# EAGLE design core-debug (EAGLE 6.4)
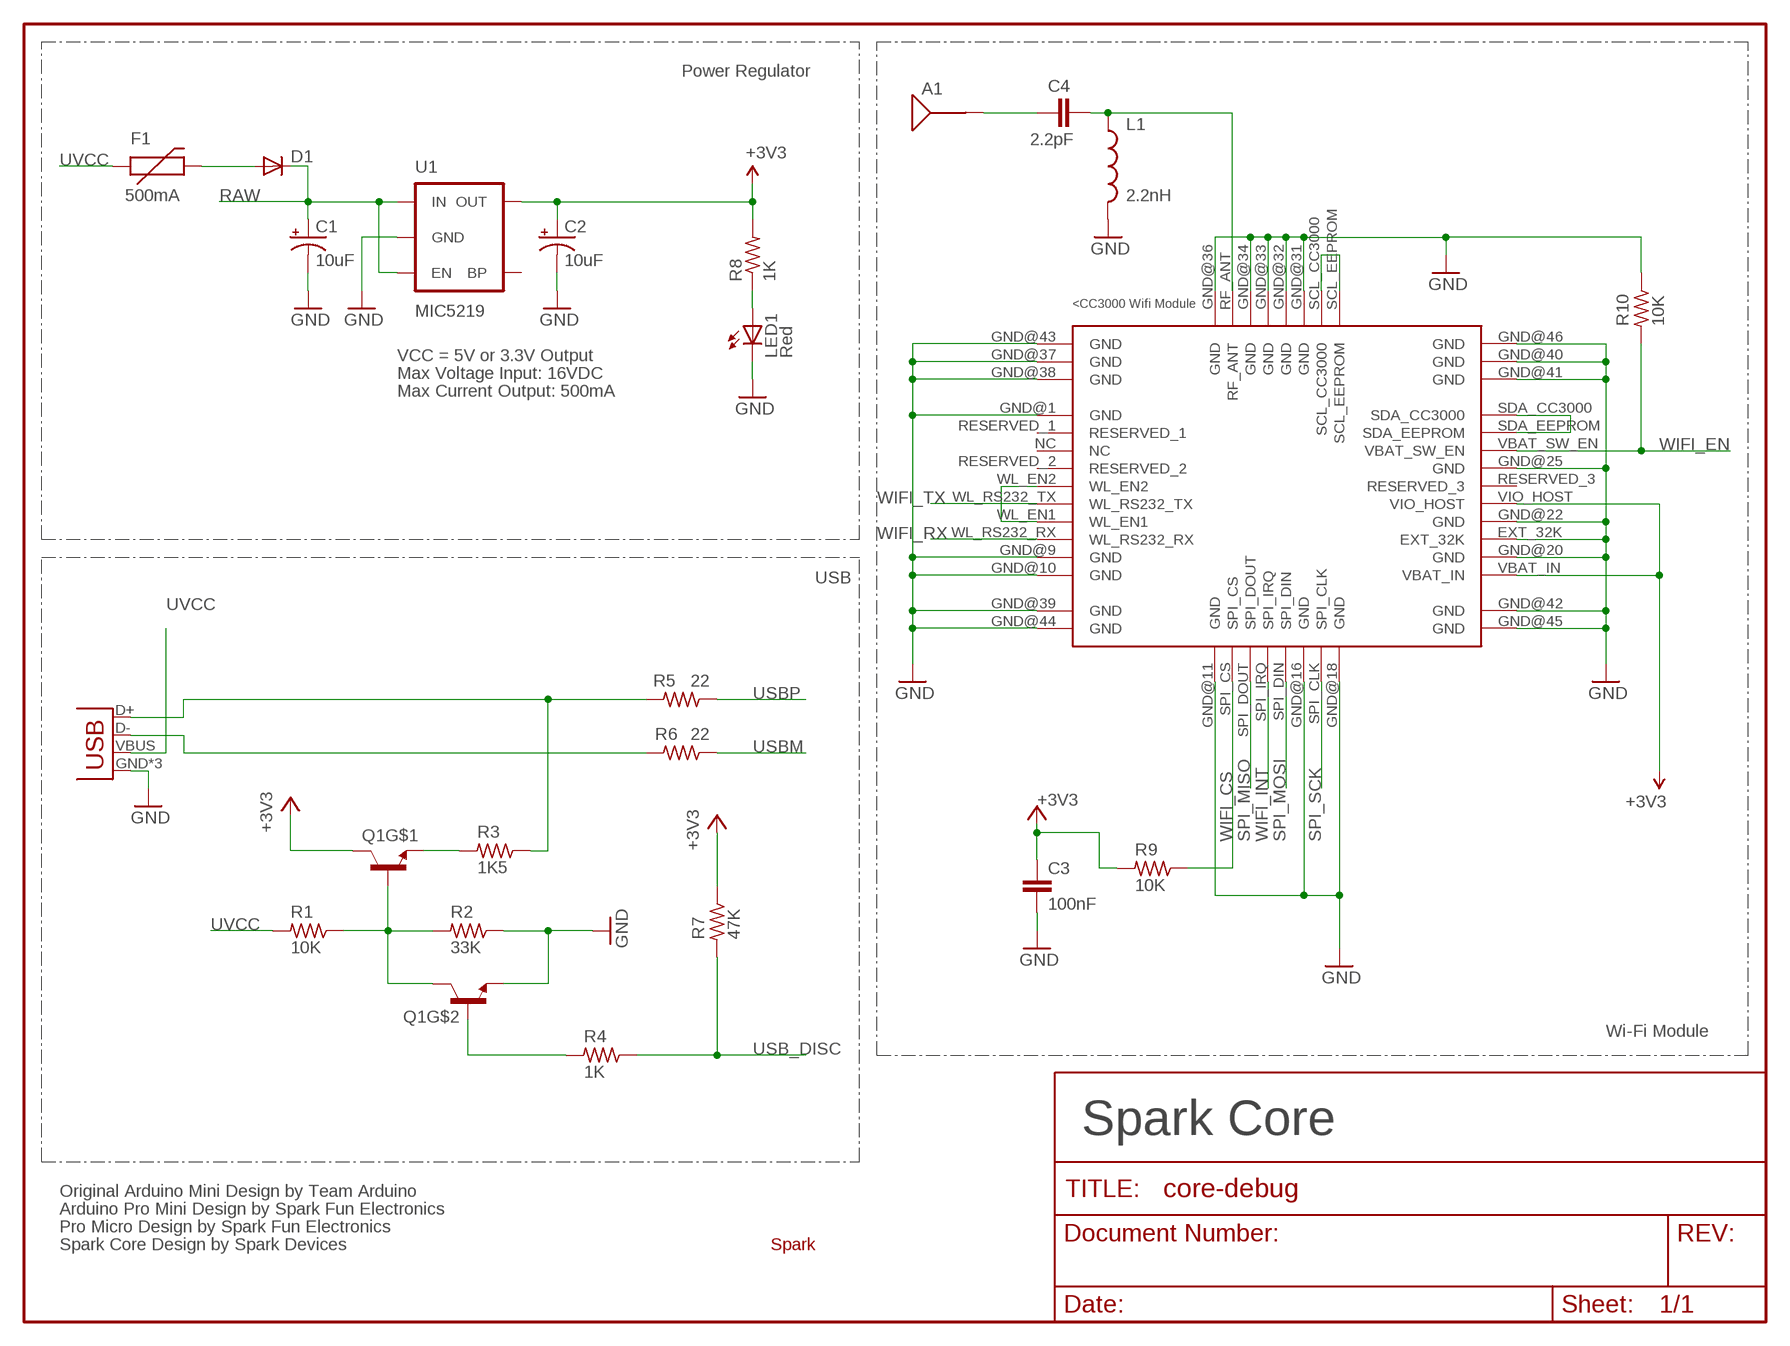
[diagram p0: schematic, sheet 1, part 1 of 2]
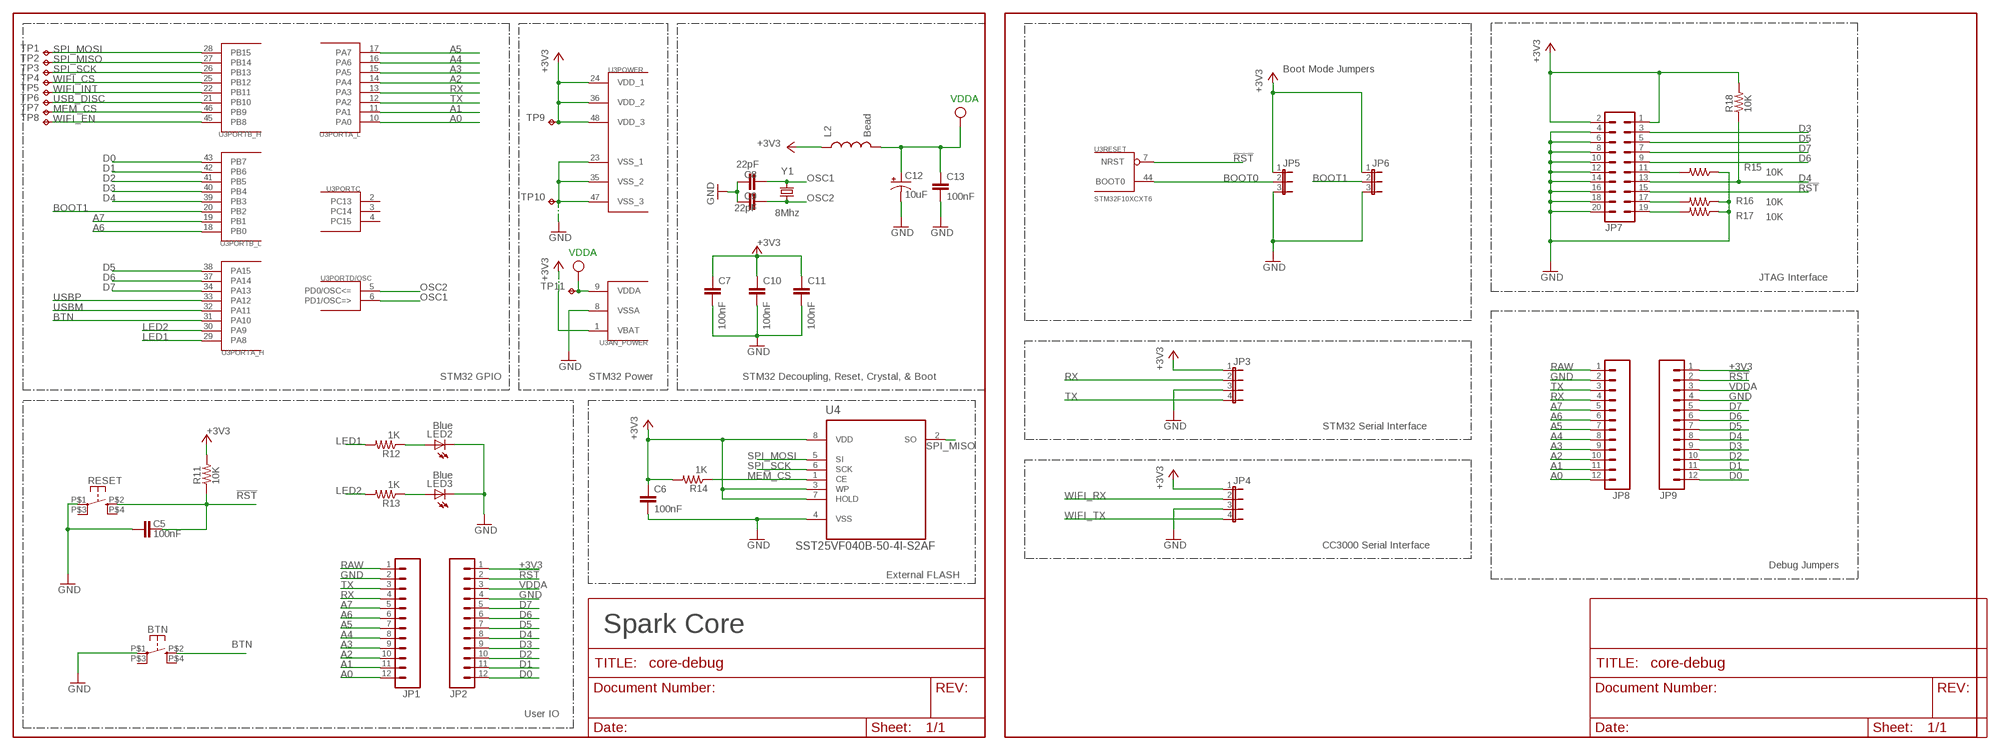
[diagram p1: schematic, sheet 1, part 2 of 2]

## Parts
A1  ANTENNA2SMD5  [ANTENNA-CHIP5]
BTN  KMR211GLFS  BUTTON-KMR241GLFS  [PUSHBUTTON-KMR241GLFS]
C1  10uF  CAP_POL1206  [EIA3216]
C2  10uF  CAP_POL1206  [EIA3216]
C3  100nF  C-EUC0603  [C0603]
C4  2.2pF  C-EUC0603  [C0603]
C5  100nF  C-EUC0603  [C0603]
C6  100nF  C-EUC0603  [C0603]
C7  100nF  C-EUC0603  [C0603]
C8  22pF  C-EUC0603  [C0603]
C9  22pF  C-EUC0603  [C0603]
C10  100nF  C-EUC0603  [C0603]
C11  100nF  C-EUC0603  [C0603]
C12  10uF  CAP_POL1206  [EIA3216]
C13  100nF  C-EUC0603  [C0603]
D1  DIODESOD  [SOD-323]
F1  500mA  PTCSMD  [PTC-1206]
JP1  M12PTH  [1X12]
JP2  M12PTH  [1X12]
JP3  JP4E  [JP4]
JP4  JP4E  [JP4]
JP5  JP2E  [JP2]
JP6  JP2E  [JP2]
JP7  ML20  [ML20]
JP8  M12PTH  [1X12]
JP9  M12PTH  [1X12]
L1  2.2nH  INDUCTOR0603  [0603]
L2  Bead  INDUCTOR0603  [0603]
LED1  Red  LED0603  [LED-0603]
LED2  Blue  LED0603  [LED-0603]
LED3  Blue  LED0603  [LED-0603]
Q1  MMDT3904  [SOT363]
R1  10K  R-US_R0603  [R0603]
R2  33K  R-US_R0603  [R0603]
R3  1K5  R-US_R0603  [R0603]
R4  1K  R-US_R0603  [R0603]
R5  22  R-US_R0603  [R0603]
R6  22  R-US_R0603  [R0603]
R7  47K  R-US_R0603  [R0603]
R8  1K  R-US_R0603  [R0603]
R9  10K  R-US_R0603  [R0603]
R10  10K  R-US_R0603  [R0603]
R11  10K  R-US_R0603  [R0603]
R12  1K  R-US_R0603  [R0603]
R13  1K  R-US_R0603  [R0603]
R14  1K  R-US_R0603  [R0603]
R15  10K  R-US_R0603  [R0603]
R16  10K  R-US_R0603  [R0603]
R17  10K  R-US_R0603  [R0603]
R18  10K  R-US_R0603  [R0603]
RESET  KMR211GLFS  BUTTON-KMR241GLFS  [PUSHBUTTON-KMR241GLFS]
TP1  TPPAD1-17  [P1-17]
TP2  TPPAD1-17  [P1-17]
TP3  TPPAD1-17  [P1-17]
TP4  TPPAD1-17  [P1-17]
TP5  TPPAD1-17  [P1-17]
TP6  TPPAD1-17  [P1-17]
TP7  TPPAD1-17  [P1-17]
TP8  TPPAD1-17  [P1-17]
TP9  TPPAD1-17  [P1-17]
TP10  TPPAD1-17  [P1-17]
TP11  TPPAD1-17  [P1-17]
U1  MIC5219  V_REG_LDOSMD  [SOT23-5]
U2  CC3000  [CC3000]
U3  STM32F10XCXT6  [TQFP48]
U4  SST25VF040B-50-4I-S2AF  [SOIC127P790X216-8N]
U$1  SPARK_LOGO2  [SPARK_LOGO2]
X1  USB-MICROB  [USB-MICROB]
Y1  8Mhz  CRYSTAL5X3  [CRYSTAL-SMD-5X3]

## Nets
!RST: C5.2 JP2.2 JP7.15 JP9.2 R11.1 RESET.P$2 U3.7(RESET:NRST)
+3V3: C2.A(+) C3.1 C6.1 C7.1 C10.1 C11.1 JP2.1 JP3.1 JP4.1 JP5.1 JP6.1 JP7.1 JP7.2 JP9.1 L2.1 Q1.3(C) R7.1 R8.2 R9.2 R11.2 R14.2 R18.2 TP9.TP U1.5(OUT) U2.VBAT_IN U2.VIO_HOST U3.1(AN_POWER:VBAT) U3.24(POWER:VDD_1) U3.36(POWER:VDD_2) U3.48(POWER:VDD_3) U4.3(WP) U4.7(HOLD) U4.8(VDD)
A0: JP1.12 JP8.12 U3.10(PORTA_L:PA0)
A1: JP1.11 JP8.11 U3.11(PORTA_L:PA1)
A2: JP1.10 JP8.10 U3.14(PORTA_L:PA4)
A3: JP1.9 JP8.9 U3.15(PORTA_L:PA5)
A4: JP1.8 JP8.8 U3.16(PORTA_L:PA6)
A5: JP1.7 JP8.7 U3.17(PORTA_L:PA7)
A6: JP1.6 JP8.6 U3.18(PORTB_L:PB0)
A7: JP1.5 JP8.5 U3.19(PORTB_L:PB1)
BOOT0: JP5.2 U3.44(RESET:BOOT0)
BOOT1: JP6.2 U3.20(PORTB_L:PB2)
BTN: BTN.P$2 U3.31(PORTA_H:PA10)
D0: JP2.12 JP9.12 U3.43(PORTB_L:PB7)
D1: JP2.11 JP9.11 U3.42(PORTB_L:PB6)
D2: JP2.10 JP9.10 U3.41(PORTB_L:PB5)
D3: JP2.9 JP7.3 JP9.9 U3.40(PORTB_L:PB4)
D4: JP2.8 JP7.13 JP9.8 R18.1 U3.39(PORTB_L:PB3)
D5: JP2.7 JP7.5 JP9.7 U3.38(PORTA_H:PA15)
D6: JP2.6 JP7.9 JP9.6 U3.37(PORTA_H:PA14)
D7: JP2.5 JP7.7 JP9.5 U3.34(PORTA_H:PA13)
GND [vcc]: BTN.P$1 C1.C(-) C2.C(-) C3.2 C5.1 C6.2 C7.2 C8.2 C9.2 C10.2 C11.2 C12.C(-) C13.2 JP1.2 JP2.4 JP3.3 JP4.3 JP5.3 JP6.3 JP7.4 JP7.6 JP7.8 JP7.10 JP7.12 JP7.14 JP7.16 JP7.18 JP7.20 JP8.2 JP9.4 L1.2 LED1.C LED2.C LED3.C Q1.1(E) R2.1 R10.1 R15.1 R16.1 R17.1 RESET.P$1 TP10.TP U1.2(GND) U2.EXT_32K U2.GND@1(GND) U2.GND@9(GND) U2.GND@10(GND) U2.GND@11(GND) U2.GND@16(GND) U2.GND@18(GND) U2.GND@20(GND) U2.GND@22(GND) U2.GND@25(GND) U2.GND@31(GND) U2.GND@32(GND) U2.GND@33(GND) U2.GND@34(GND) U2.GND@36(GND) U2.GND@37(GND) U2.GND@38(GND) U2.GND@39(GND) U2.GND@40(GND) U2.GND@41(GND) U2.GND@42(GND) U2.GND@43(GND) U2.GND@44(GND) U2.GND@45(GND) U2.GND@46(GND) U3.8(AN_POWER:VSSA) U3.23(POWER:VSS_1) U3.35(POWER:VSS_2) U3.47(POWER:VSS_3) U4.4(VSS) X1.GND X1.MT1(GND) X1.MT2(GND)
LED1: R12.2 U3.29(PORTA_H:PA8)
LED2: R13.2 U3.30(PORTA_H:PA9)
MEM_CS: R14.1 TP7.TP U3.46(PORTB_H:PB9) U4.1(CE)
N$1: R3.1 R5.2 X1.D+
N$2: LED2.A R12.1
N$3: D1.2(A) F1.2
N$4: C4.2 L1.1 U2.RF_ANT
N$5: A1.FEED(SIGNAL) C4.1
N$6: R6.2 X1.D-
N$7: U2.SCL_CC3000 U2.SCL_EEPROM
N$8: Q1.2(B) R4.2
N$9: U2.WL_EN1 U2.WL_EN2
N$10: LED3.A R13.1
N$11: JP7.19 R17.2
N$12: JP7.11 R15.2
N$13: Q1.5(B) Q1.6(C) R1.1 R2.2
N$14: JP7.17 R16.2
N$15: U2.SDA_CC3000 U2.SDA_EEPROM
N$16: Q1.4(E) R3.2
N$38: LED1.A R8.1
OSC1: C8.1 U3.6(PORTD/OSC:PD1/OSC=>) Y1.3
OSC2: C9.1 U3.5(PORTD/OSC:PD0/OSC<=) Y1.1
RAW [vcc]: C1.A(+) D1.1(C) JP1.1 JP8.1 U1.1(IN) U1.3(EN)
RX: JP1.4 JP3.2 JP8.4 U3.13(PORTA_L:PA3)
SPI_MISO: TP2.TP U2.SPI_DOUT U3.27(PORTB_H:PB14) U4.2(SO)
SPI_MOSI: TP1.TP U2.SPI_DIN U3.28(PORTB_H:PB15) U4.5(SI)
SPI_SCK: TP3.TP U2.SPI_CLK U3.26(PORTB_H:PB13) U4.6(SCK)
TX: JP1.3 JP3.4 JP8.3 U3.12(PORTA_L:PA2)
USB_DISC: R4.1 R7.2 TP6.TP U3.21(PORTB_H:PB10)
USBM: R6.1 U3.32(PORTA_H:PA11)
USBP: R5.1 U3.33(PORTA_H:PA12)
UVCC: F1.1 R1.2 X1.VBUS
VDDA: C12.A(+) C13.1 JP2.3 JP9.3 L2.2 TP11.TP U3.9(AN_POWER:VDDA) ; supply symbol labelled VCC
WIFI_CS: R9.1 TP4.TP U2.SPI_CS U3.25(PORTB_H:PB12)
WIFI_EN: R10.2 TP8.TP U2.VBAT_SW_EN U3.45(PORTB_H:PB8)
WIFI_INT: TP5.TP U2.SPI_IRQ U3.22(PORTB_H:PB11)
WIFI_RX: JP4.2 U2.WL_RS232_RX
WIFI_TX: JP4.4 U2.WL_RS232_TX
Unconnected: BTN.P$3 BTN.P$4 RESET.P$3 RESET.P$4 U1.4(BP) U2.NC U2.RESERVED_1 U2.RESERVED_2 U2.RESERVED_3 U3.2(PORTC:PC13) U3.3(PORTC:PC14) U3.4(PORTC:PC15)

## Notes on the sheet
- Power Regulator
- Boot Mode Jumpers
- VDDA
- VCC = 5V or 3.3V Output
- Max Voltage Input: 16VDC
- Max Current Output: 500mA
- VDDA
- JTAG Interface
- USB
- STM32 GPIO | STM32 Power | STM32 Decoupling, Reset, Crystal, & Boot
- STM32 Serial Interface
- CC3000 Serial Interface
- Debug Jumpers
- Wi-Fi Module | External FLASH
- Spark Core | Spark Core
- Original Arduino Mini Design by Team Arduino
- Arduino Pro Mini Design by Spark Fun Electronics
- Pro Micro Design by Spark Fun Electronics
- Spark Core Design by Spark Devices
- User IO

## Library data of the parts
A1 = SparkFun-RF:ANTENNA2: Chip antenna Single endded antenna. Common with smaller chip antennas. CHIP4 package is the GPS Chip Antenna SKU: GPS-08418. CHIP5 package is 2.4GHz chip antenna SKU: WRL-00144.
BTN RESET = okie:BUTTON-KMR241GLFS
C1 C2 C12 = SparkFun:CAP_POL: Capacitor Polarized These are standard SMD and PTH capacitors. Normally 10uF, 47uF, and 100uF in electrolytic and tantalum varieties. Always verify the external diameter of the through hole cap, it varies with capacity, voltage, and manufacturer. The EIA devices should be standard.
C3-C11 C13 = rcl:C-EU: CAPACITOR, European symbol
D1 = SparkFun:DIODE: Diode These are standard reverse protection diodes and small signal diodes. SMA package can handle up to about 1A. SOD-323 can handle about 200mA. What the SOD-323 package when ordering, there are some mfgs out there that are 5-pin packages.
F1 = SparkFun:PTC: Resettable Fuse PTC Resettable Fuse. Spark Fun Electronics SKU : COM-08357
JP1 JP2 JP8 JP9 = SparkFun:M12: Header 12 Standard 12-pin 0.1" header. Use with straight break away headers (SKU : PRT-00116), right angle break away headers (PRT-00553), swiss pins (PRT-00743), machine pins (PRT-00117), and female headers (PRT-00115).
JP3 JP4 = jumper:JP4E: JUMPER
JP5 JP6 = jumper:JP2E: JUMPER
JP7 = con-harting-ml:ML20: HARTING
L1 L2 = SparkFun-Passives:INDUCTOR: Inductors Basic Inductor/Choke - 0603 and 1206. Footprints are not proven and vary greatly between part numbers.
LED1-LED3 = SparkFun:LED: LEDs Standard schematic elements and footprints for 5mm, 3mm, 1206, and 0603 sized LEDs. 5mm - Spark Fun Electronics SKU : COM-00529 (and others)
Q1 = SparkFun-DiscreteSemi:MMDT3904: Dual NPN transistor
R1-R18 = rcl:R-US_: RESISTOR, American symbol
TP1-TP11 = testpad:TP: Test pad
U1 = SparkFun:V_REG_LDO: Voltage Regulator LDO Standard 150mA LDO voltage regulator in SOT-23 layout. Micrel part MIC5205. BP (by-pass) pin is used to lower output noise with 470pF cap.
U2 = CC3000:CC3000
U3 = stm32:STM32F10XCXT6: ST STM32F101/103 48pin LQFP
U4 = Silicon_Storage_Tech_By_element14_Batch_1:SST25VF040B-50-4I-S2AF: 4 Mbit SPI Serial Flash; MPN: SST25VF040B-50-4I-S2AF; OC_FARNELL: 1368690; OC_NEWARK: -; PACKAGE: SOIC-8; SUPPLIER: SILICON STORAGE TECHNOLOGY
U$1 = Spark:SPARK_LOGO2
X1 = SparkFun-Connectors:USB: USB Connectors USB-B-PTH is fully proven SKU : PRT-00139/CONN-08278 USB-miniB is fully proven SKU : PRT-00587 USB-A-PCB is untested. USB-A-H is throughly reviewed, but untested. Spark Fun Electronics SKU : PRT-00437 USB-B-SMT is throughly reviewed, but untested. Needs silkscreen touching up. USB-A-S has not been used/tested USB-MB-H has not been used/tested USB-MICROB has been used. CONN-09505; PROD_ID: CONN-09505
Y1 = SparkFun:CRYSTAL: Crystals Various standard crystals. Proven footprints. Spark Fun Electronics SKU : COM-00534

## Board
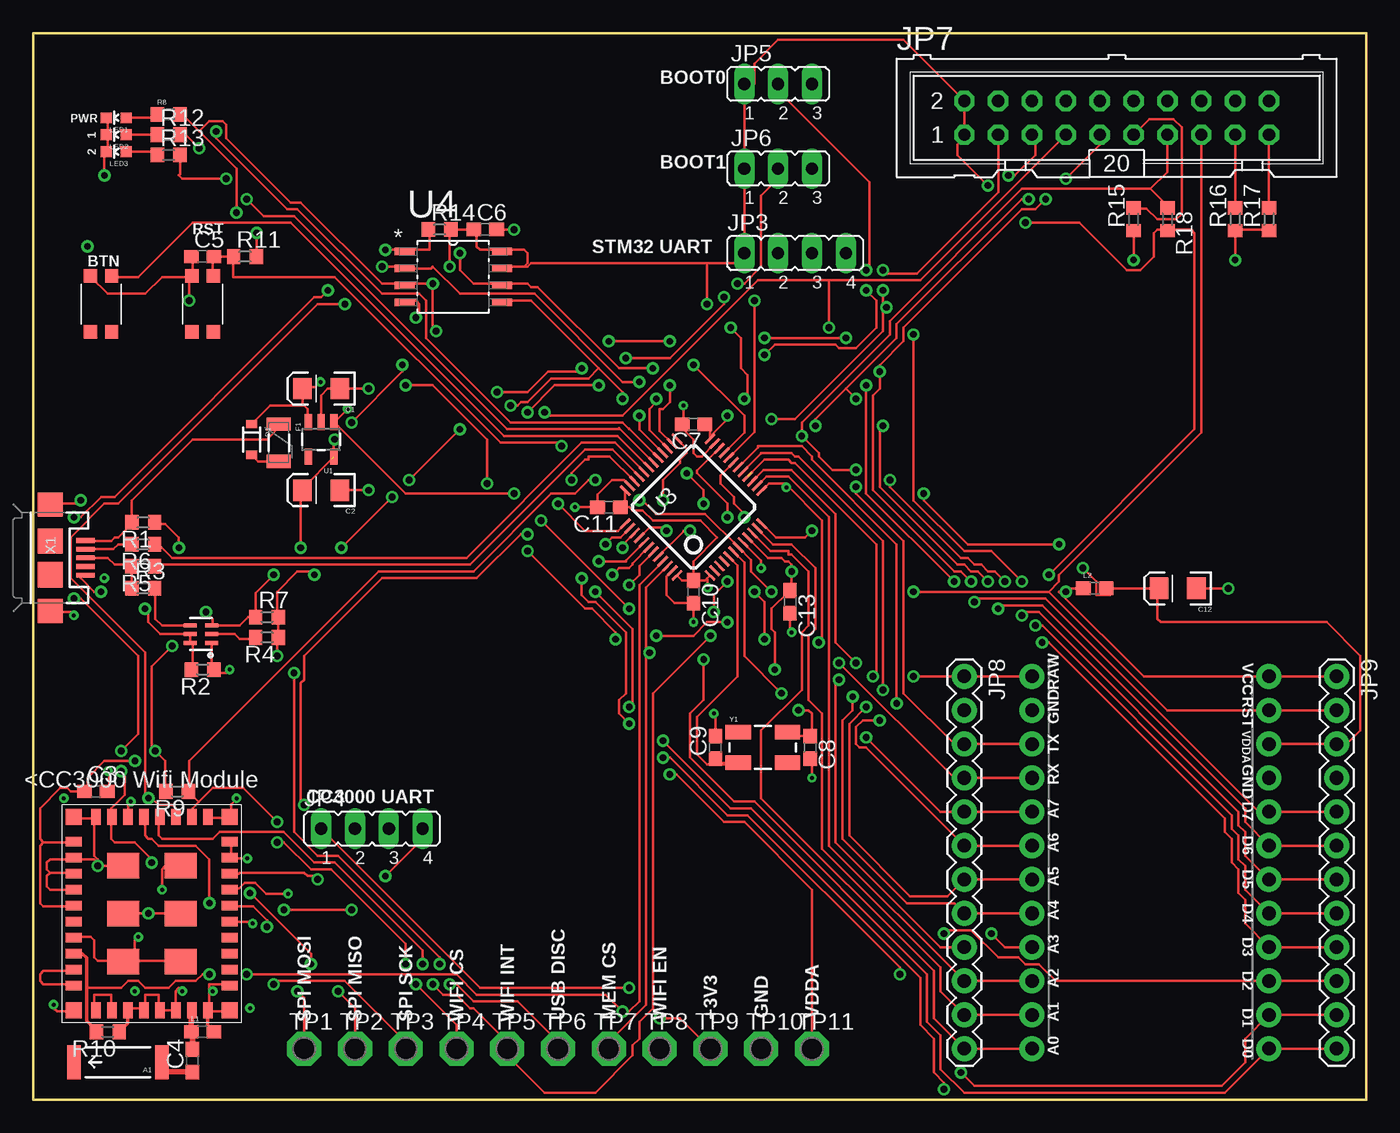
[diagram p2: board, top side]
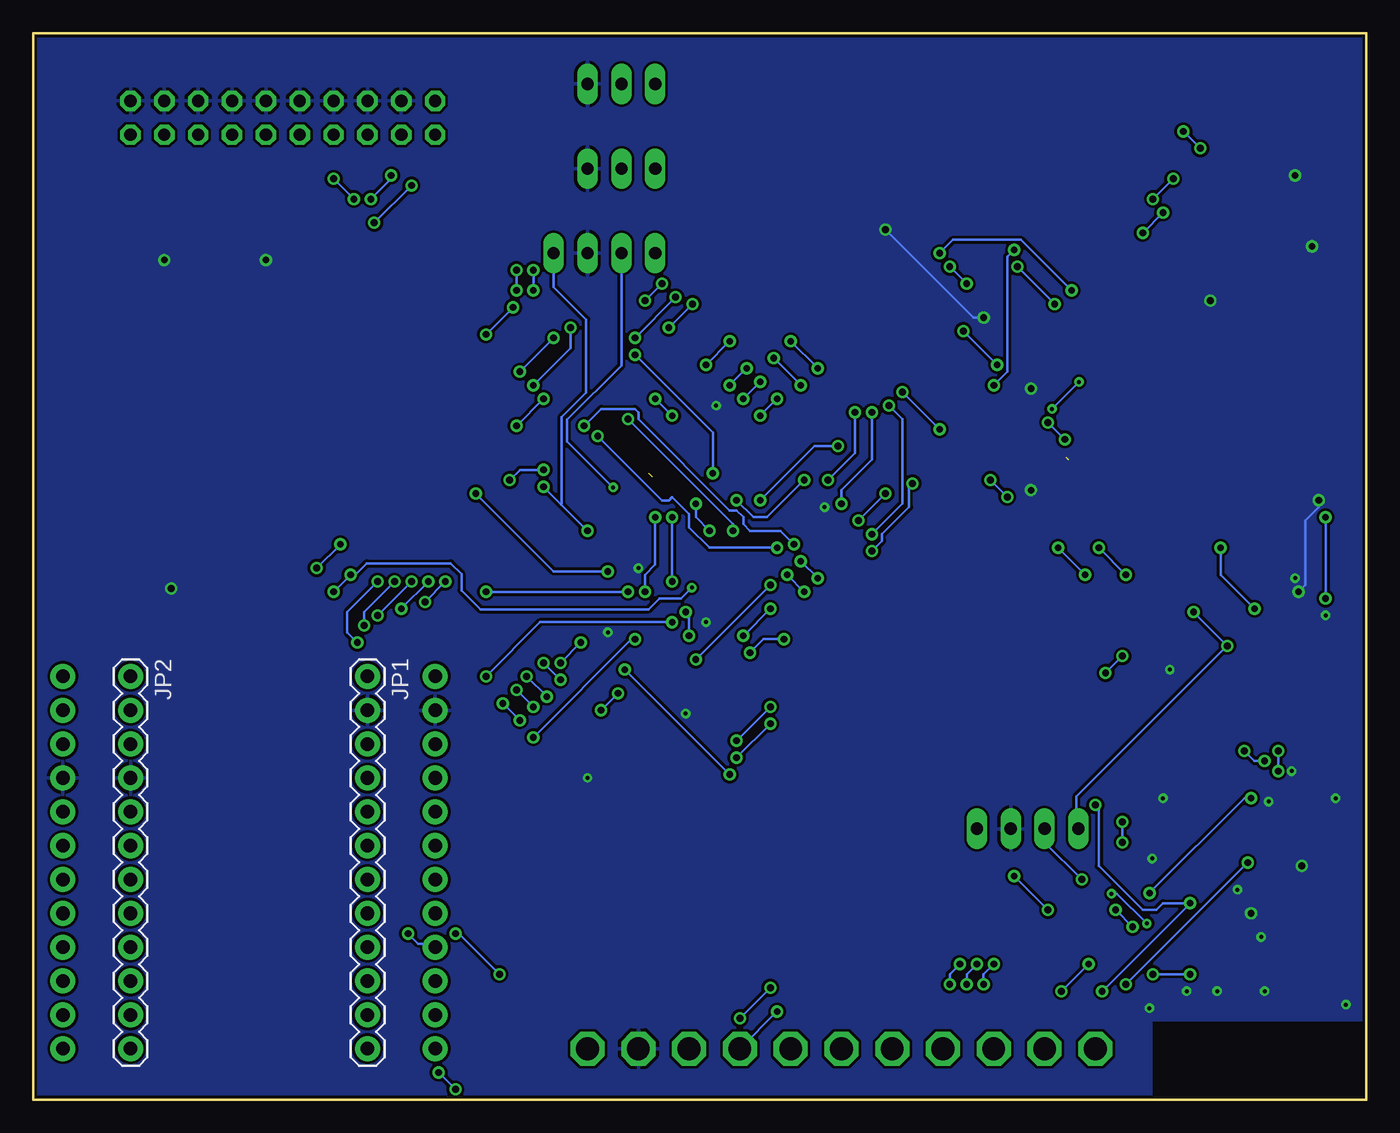
[diagram p3: board, bottom side, seen from below]

Size 100 x 80 mm. Coordinates in mm from the lower left corner, seen from the top.
Outline: 0,80 0,0 100,0 100,80 0,80
Copper layers (1*16): Top 0.035mm / dielectric 1.5mm / Bottom 0.035mm
Design rules "default *": minimum track width 6mil, minimum drill 0.3mm, track to track 8mil, track to pad 8mil, pad to pad 8mil, via to via 8mil, smd to smd 8mil, copper to edge 8mil, drill to drill 8mil, minimum pad ring 12mil, minimum via ring 8mil, stop-mask expansion 4mil, vias tented up to drill 20mil, thermal gap 10mil
bRestrict: area 0,0 to 16,5.8

### Footprints (pad centres in the part's own frame; a part is rotated, then mirrored left to right if it is on the bottom)
ANTENNA-CHIP5 = smd 1.016 x 2.54: FEED -3.302,0; NC 3.302,0
PUSHBUTTON-KMR241GLFS = smd 1 x 1: P$1 2.1,0.8; P$2 2.1,-0.8; P$3 -2.1,0.8; P$4 -2.1,-0.8
EIA3216 = smd 1.4 x 1.6: A 1.4,0; C -1.4,0
C0603 = smd 1.1 x 1: 1 -0.85,0; 2 0.85,0
SOD-323 = smd 0.63 x 0.83: 1 -1.15,0; 2 1.15,0
PTC-1206 = smd 1 x 1.8: 1 -1.4,0; 2 1.4,0
1X12 = drill 1.016 pad 1.88: 1 0,0; 2 2.54,0; 3 5.08,0; 4 7.62,0; 5 10.16,0; 6 12.7,0; 7 15.24,0; 8 17.78,0; 9 20.32,0; 10 22.86,0; 11 25.4,0; 12 27.94,0
JP4 = drill 0.914 long: 1 -3.81,0; 2 -1.27,0; 3 1.27,0; 4 3.81,0
JP2 = drill 0.914 long: 1 -2.54,0; 2 0,0; 3 2.54,0
ML20 = drill 0.914 octagon: 1 -11.43,-1.27; 2 -11.43,1.27; 3 -8.89,-1.27; 4 -8.89,1.27; 5 -6.35,-1.27; 6 -6.35,1.27; 7 -3.81,-1.27; 8 -3.81,1.27; 9 -1.27,-1.27; 10 -1.27,1.27; 11 1.27,-1.27; 12 1.27,1.27; 13 3.81,-1.27; 14 3.81,1.27; 15 6.35,-1.27; 16 6.35,1.27; 17 8.89,-1.27; 18 8.89,1.27; 19 11.43,-1.27; 20 11.43,1.27
0603 = smd 1.1 x 1: 1 -0.85,0; 2 0.85,0
LED-0603 = smd 0.8 x 0.8: A 0,-0.75; C 0,0.75
SOT363 = smd 0.3 x 0.99: 1 -0.65,-0.8; 2 0,-0.8; 3 0.65,-0.8; 4 0.65,0.81; 5 0,0.81; 6 -0.65,0.81
R0603 = smd 1 x 1.1: 1 -0.85,0; 2 0.85,0
P1-17 = drill 1.702 pad 2.54 octagon: TP 0,0
SOT23-5 = smd 0.55 x 1.2: 1 -0.95,-1.3; 2 0,-1.3; 3 0.95,-1.3; 4 0.95,1.3; 5 -0.95,1.3
CC3000 = smd 1.2 x 0.7: EXT_32K 5.85,-2.97; GND@1 -5.85,5.43; GND@9 -5.85,-4.17; GND@10 -5.85,-5.37; GND@20 5.85,-4.17; GND@22 5.85,-1.77; GND@25 5.85,1.83; NC -5.85,3.03; RESERVED_1 -5.85,4.23; RESERVED_2 -5.85,1.83; RESERVED_3 5.85,0.63; SDA_CC3000 5.85,5.43; SDA_EEPROM 5.85,4.23; VBAT_IN 5.85,-5.37; VBAT_SW_EN 5.85,3.03; VIO_HOST 5.85,-0.57; WL_EN1 -5.85,-1.77; WL_EN2 -5.85,0.63; WL_RS232_RX -5.85,-2.97; WL_RS232_TX -5.85,-0.57 | smd 0.7 x 1.2: GND@11 -4.2,-7.22; GND@16 1.8,-7.22; GND@18 4.2,-7.22; GND@31 1.8,7.28; GND@32 0.6,7.28; GND@33 -0.6,7.28; GND@34 -1.8,7.28; GND@36 -4.2,7.28; RF_ANT -3,7.28; SCL_CC3000 3,7.28; SCL_EEPROM 4.2,7.28; SPI_CLK 3,-7.22; SPI_CS -3,-7.22; SPI_DIN 0.6,-7.22; SPI_DOUT -1.8,-7.22; SPI_IRQ -0.6,-7.22 | smd 2.4 x 1.9: GND@37 -2.15,3.63; GND@38 -2.15,0.03; GND@39 -2.15,-3.57; GND@40 2.15,3.63; GND@41 2.15,0.03; GND@42 2.15,-3.57 | smd 1.2 x 1.2: GND@43 -5.85,7.28; GND@44 -5.85,-7.22; GND@45 5.85,-7.22; GND@46 5.85,7.28
TQFP48 = smd 0.2 x 1: 1 -2.75,-4.5; 2 -2.25,-4.5; 3 -1.75,-4.5; 4 -1.25,-4.5; 5 -0.75,-4.5; 6 -0.25,-4.5; 7 0.25,-4.5; 8 0.75,-4.5; 9 1.25,-4.5; 10 1.75,-4.5; 11 2.25,-4.5; 12 2.75,-4.5; 25 2.75,4.5; 26 2.25,4.5; 27 1.75,4.5; 28 1.25,4.5; 29 0.75,4.5; 30 0.25,4.5; 31 -0.25,4.5; 32 -0.75,4.5; 33 -1.25,4.5; 34 -1.75,4.5; 35 -2.25,4.5; 36 -2.75,4.5 | smd 1 x 0.2: 13 4.5,-2.75; 14 4.5,-2.25; 15 4.5,-1.75; 16 4.5,-1.25; 17 4.5,-0.75; 18 4.5,-0.25; 19 4.5,0.25; 20 4.5,0.75; 21 4.5,1.25; 22 4.5,1.75; 23 4.5,2.25; 24 4.5,2.75; 37 -4.5,2.75; 38 -4.5,2.25; 39 -4.5,1.75; 40 -4.5,1.25; 41 -4.5,0.75; 42 -4.5,0.25; 43 -4.5,-0.25; 44 -4.5,-0.75; 45 -4.5,-1.25; 46 -4.5,-1.75; 47 -4.5,-2.25; 48 -4.5,-2.75
SOIC127P790X216-8N = smd 1.499 x 0.559: 1 -3.658,1.905; 2 -3.658,0.635; 3 -3.658,-0.635; 4 -3.658,-1.905; 5 3.658,-1.905; 6 3.658,-0.635; 7 3.658,0.635; 8 3.658,1.905
USB-MICROB = smd 0.35 x 1.4: D+ 0,2.65; D- -0.65,2.65; GND 1.3,2.65; ID 0.65,2.65; VBUS -1.3,2.65 | smd 1.8 x 1.9: MT1 -4,0; MT2 4,0 | smd 1.9 x 1.9: P$1 -1.27,0; P$2 1.27,0
CRYSTAL-SMD-5X3 = smd 1.9 x 1.1: 1 -1.85,-1.15; 2 1.85,-1.15; 3 1.85,1.15; 4 -1.85,1.15

### Placement (x,y rotation side)
A1  6.35,2.79 180 top
BTN  5.08,59.69 90 top
C1  21.59,53.34 180 top
C2  21.59,45.72 180 top
C3  4.7,23.11 0 top
C4  11.94,2.92 90 top
C5  12.7,63.25 0 top
C6  33.91,65.28 0 top
C7  49.53,50.67 180 top
C8  58.29,26.42 270 top
C9  51.18,26.42 90 top
C10  49.53,38.1 270 top
C11  43.18,44.45 180 top
C12  85.85,38.35 180 top
C13  56.77,37.34 270 top
D1  16.38,49.53 270 top
F1  18.41,49.28 270 top
JP1  74.93,31.75 270 bottom
JP2  92.71,31.75 270 bottom
JP3  57.15,63.5 0 top
JP4  25.4,20.32 0 top
JP5  55.88,76.2 0 top
JP6  55.88,69.85 0 top
JP7  81.28,73.66 0 top
JP8  69.85,31.75 270 top
JP9  97.79,31.75 270 top
L1  12.7,5.08 0 top
L2  79.63,38.35 0 top
LED1  6.22,73.66 90 top
LED2  6.22,72.39 90 top
LED3  6.22,71.12 90 top
Q1  12.57,34.92 90 top
R1  8.26,43.31 180 top
R2  12.7,32.26 180 top
R3  8.26,38.35 0 top
R4  17.53,34.67 180 top
R5  8.26,40.01 180 top
R6  8.26,41.66 180 top
R7  17.53,36.2 0 top
R8  10.16,73.91 0 top
R9  10.79,23.11 180 top
R10  5.59,5.08 180 top
R11  15.88,63.25 0 top
R12  10.16,72.39 0 top
R13  10.16,70.87 0 top
R14  30.48,65.28 0 top
R15  82.55,66.04 90 top
R16  90.17,66.04 90 top
R17  92.71,66.04 90 top
R18  85.09,66.04 270 top
RESET  12.7,59.69 90 top
TP1  20.32,3.81 0 top
TP2  24.13,3.81 0 top
TP3  27.94,3.81 0 top
TP4  31.75,3.81 0 top
TP5  35.56,3.81 0 top
TP6  39.37,3.81 0 top
TP7  43.18,3.81 0 top
TP8  46.99,3.81 0 top
TP9  50.8,3.81 0 top
TP10  54.61,3.81 0 top
TP11  58.42,3.81 0 top
U1  21.59,49.53 180 top
U2  8.89,13.97 180 top
U3  49.53,44.45 45 top
U4  31.5,61.72 0 top
U$1  91.44,33.02 0 top
X1  1.27,40.64 270 top
Y1  54.74,26.42 0 top

### Tracks (layer width: path | path; a pad name or v marks a point on that pad's centre or on a via)
!RST  (via drill 0.51)
  Top 0.203: RESET.P$2 13.46,61.98 13.46,63.25 C5.2 14.99,63.25 | 14.99,63.25 14.99,61.72 22.61,61.72 35.05,49.28 39.37,49.28 v39.62,49.02 | v45.47,44.96 45.72,44.96 46.74,43.94 50.39,43.94 U3.7 53.85,40.49 53.85,39.62 v55.37,38.1 | 14.99,63.25 R11.1 | 76.2,38.1 v66.04,38.1 | 76.2,38.1 85.09,29.21 JP2.2 JP9.2 | JP7.15 87.63,50.04 76.96,39.37 76.96,38.86 76.2,38.1
  Bottom 0.203: v39.62,49.02 41.4,49.02 v45.47,44.96 | v66.04,38.1 v55.37,38.1
+3V3  (via drill 0.3, 0.51)  (1 unrouted)
  Top 0.203: U3.48 48.67,38.95 C10.1 | U3.1 50.53,39.08 | 50.53,39.08 50.39,38.95 C10.1 | U3.36 44.4,44.82 C11.1 44.7,44.45 44.96,44.2 45.72,44.2 46.48,43.43 50.04,43.43 51.31,42.16 49.53,40.39 C10.1 | C7.1 50.77,50.29 50.77,49.78 | 50.77,49.78 U3.24 | 13.46,35.56 15.49,35.56 16.13,36.2 R7.1 16.68,38.01 v18.03,39.37 | 22.35,48.01 22.61,47.75 | 20.07,45.72 20.07,45.97 20.32,45.97 22.54,48.19 U1.5 | v20.07,41.4 20.07,45.72 | 20.07,45.72 C2.A | 12.45,72.64 15.24,69.85 v15.24,66.55 | v16.76,65.02 16.76,63.25 R11.2 | 36.83,62.48 37.08,62.74 37.08,63.5 36.83,63.75 35.31,63.75 U4.8 35.05,63.75 33.53,63.75 33.27,64.01 33.27,65.28 C6.1 R14.2 31.24,65.28 v31.24,62.48 | 36.83,62.48 35.31,62.48 U4.7 | 12.45,72.64 13.21,73.41 14.22,73.41 14.48,73.15 14.48,72.14 19.3,67.31 20.07,67.31 26.16,61.21 27.69,61.21 U4.3 27.94,61.21 v29.97,61.21 29.97,57.91 v30.23,57.66 | 36.83,62.48 37.08,62.48 37.34,62.74 50.55,62.74 | 50.55,62.74 52.58,62.74 JP3.1 JP6.1 JP5.1 54.1,76.2 54.1,77.72 55.88,79.5 65.28,79.5 JP7.2 JP7.1 69.85,72.14 69.34,71.63 69.34,70.87 v71.63,68.58 | JP9.1 JP2.1 83.31,31.75 76.96,38.1 77.22,38.35 77.47,38.35 | L2.1 77.47,38.35 | TP9.TP 48.51,6.1 v46.99,6.1 | v44.7,8.38 33.53,8.38 JP4.1 | U2.VIO_HOST 2.79,14.48 0.76,14.48 0.51,14.73 0.51,19.05 0.76,19.3 | 0.76,19.3 2.79,19.3 U2.VBAT_IN | 0.76,19.3 0.51,19.56 0.51,21.84 2.03,23.37 2.54,23.37 2.79,23.11 C3.1 4.06,23.11 4.06,24.13 5.33,25.4 v7.62,25.4 | v27.69,55.12 27.69,54.61 v23.88,50.8 | 22.61,48.26 U1.5 | 13.46,35.56 Q1.3 | 13.46,35.56 13.46,36.07 v12.95,36.58 | v10.41,34.04 8.89,32.51 8.89,26.42 v9.14,26.16 9.91,25.4 9.91,23.11 R9.2
  Top 0.203: v74.42,65.79 78.49,65.79 82.04,62.23 83.06,62.23 84.07,63.25 84.07,65.02 84.33,65.28 85.09,65.28 | v77.47,38.1 77.47,38.35 | v76.2,39.37 87.12,50.29 87.12,65.02 86.87,65.28 85.09,65.28 | 85.09,65.28 R18.2 | v53.34,52.58 53.59,52.83 53.59,54.36 53.09,54.86 53.09,57.15 v52.32,57.91 | v52.07,51.31 52.07,51.05 50.8,49.78 50.77,49.78 | 50.55,62.74 v50.55,59.69 | v50.6,38.41 50.6,39.01 50.53,39.08 | v22.61,49.53 22.54,49.46 U1.5 | 12.45,72.64 11.18,73.91 R8.2
  Bottom 0.203: v18.03,39.37 v20.07,41.4 | v16.76,65.02 v15.24,66.55 | v31.24,62.48 v29.97,61.21 | v44.7,8.38 v46.99,6.1 | v27.69,55.12 v30.23,57.66 | v22.61,49.53 v23.88,50.8 | v12.95,36.58 v10.41,34.04 10.46,34.04 21.74,22.76 21.74,20.32 JP4.1 | v7.62,25.4 8.38,25.4 v9.14,26.16 | v74.42,65.79 v71.63,68.58 | v77.47,38.1 v76.2,39.37 76.2,39.42 75.79,39.42 74.98,40.23 68.68,40.23 67.87,39.42 67.87,38.2 66.45,36.78 53.85,36.78 53.03,37.59 51.41,37.59 v50.6,38.41 | v52.07,51.31 v53.34,52.58 | v50.55,59.69 v52.32,57.91
A0
  Top 0.203: U3.10 55.31,41.15 56.64,41.15 56.64,40.89 56.9,40.89 58.17,39.62 58.17,35.56 57.66,35.05 57.66,30.73 54.61,27.69 54.61,22.61 67.56,9.65 67.56,6.1 JP8.12 JP1.12
A1
  Top 0.203: U3.11 55.51,41.66 56.9,41.66 58.67,39.88 58.67,35.31 58.17,34.8 58.17,29.97 59.18,28.96 59.18,18.8 68.07,9.91 68.07,8.13 JP8.11 JP1.11
A2
  Top 0.203: U3.14 55,46.74 56.64,46.74 59.69,43.69 59.69,19.05 JP8.10 JP1.10
A3  (via drill 0.51)
  Top 0.203: U3.15 54.8,47.24 56.9,47.24 60.2,43.94 60.2,34.29 v61.72,32.77 | JP8.9 68.07,11.43 60.2,19.3 60.2,31.24 v60.45,31.5 | JP1.9 72.9,11.43 v71.88,12.45
  Bottom 0.203: v61.72,32.77 v60.45,31.5 | v71.88,12.45 71.12,11.68 70.1,11.68 JP8.9
A4  (via drill 0.51)  (1 unrouted)
  Top 0.203: JP1.8 JP8.8 69.09,14.73 65.53,14.73 60.71,19.56 60.71,28.45 61.47,29.21 v61.47,30.23 | v62.99,31.75 63.25,32 63.25,41.66 57.15,47.75 56.9,47.75 56.64,48.01 55.37,48.01 54.86,48.01 53.85,46.99
  Bottom 0.203: v61.47,30.23 v62.99,31.75
A5  (via drill 0.51)
  Top 0.203: JP1.7 JP8.7 68.58,15.24 65.79,15.24 61.21,19.81 61.21,28.19 v62.48,29.46 | v63.75,30.73 63.75,41.91 57.4,48.26 57.15,48.26 56.9,48.51 54.61,48.51 54.61,48.47 U3.17
  Bottom 0.203: v62.48,29.46 v63.75,30.73
A6  (via drill 0.51)
  Top 0.203: JP1.6 JP8.6 62.48,26.42 61.98,26.42 61.72,26.67 61.72,27.94 62.23,28.45 v63.5,28.45 | v64.77,29.72 64.77,41.66 58.42,48.01 58.42,48.26 57.66,49.02 54.36,49.02 54.36,48.92 U3.18
  Bottom 0.203: v63.5,28.45 v64.77,29.72
A7  (via drill 0.51)
  Top 0.203: JP1.5 JP8.5 68.07,21.59 v62.48,27.18 | v54.86,34.54 54.86,37.34 v54.1,38.1 | v53.34,43.69 53.34,43.94 52.58,44.7 52.58,45.21 51.56,46.23 51.56,46.84 U3.19
  Bottom 0.203: v62.48,27.18 55.12,34.54 v54.86,34.54 | v54.1,38.1 54.1,39.37 53.34,40.13 v53.34,43.69
BOOT0  (via drill 0.51)
  Top 0.203: v49.28,42.67 48.77,42.67 48.77,42.63 U3.44 | v50.29,44.7 50.29,45.72 v49.02,46.99 | v54.86,55.88 55.63,56.64 60.2,56.64 60.45,56.39 61.72,56.39 63.25,57.91 63.25,59.94 v62.48,60.71 | v62.48,62.23 62.74,62.48 62.74,68.83 55.88,75.69 JP5.2
  Bottom 0.203: v49.28,42.67 50.29,43.69 v50.29,44.7 | v49.02,46.99 49.02,50.04 v54.86,55.88 | v62.48,62.23 v62.48,60.71
BOOT1  (via drill 0.51)
  Top 0.203: U3.20 54.1,50.08 v54.1,59.94 | v52.83,61.21 53.34,61.21 54.61,62.48 54.61,67.82 55.88,69.09 JP6.2
  Bottom 0.203: v52.83,61.21 v54.1,59.94
BTN
  Top 0.203: U3.31 43.84,49.78 35.31,49.78 19.3,65.79 11.94,65.79 7.87,61.72 6.1,61.72 BTN.P$2
D0  (via drill 0.51)
  Top 0.203: U3.43 45.47,40.03 45.47,39.37 v44.7,38.61 | v50.29,33.02 50.29,29.97 49.28,28.96 49.28,25.65 52.58,22.35 54.1,22.35 67.06,9.4 67.06,5.84 68.07,4.83 68.07,2.29 69.85,0.51 89.41,0.51 JP2.12 JP9.12
  Bottom 0.203: v50.29,33.02 v44.7,38.61
D1  (via drill 0.51)
  Top 0.203: U3.42 44.96,40.23 44.96,40.13 44.7,39.88 43.94,39.88 v43.43,39.37 | v42.16,38.1 44.96,35.31 44.96,29.72 v44.7,29.46 | v47.24,26.92 52.32,21.84 53.85,21.84 66.55,9.14 66.55,5.59 67.56,4.57 67.56,2.03 68.33,1.27 v68.33,0.76 | v69.6,2.03 70.61,1.02 89.15,1.02 90.93,2.79 90.93,4.57 JP2.11 JP9.11
  Bottom 0.203: v42.16,38.1 v43.43,39.37 | v47.24,26.92 v44.7,29.46 | v69.6,2.03 v68.33,0.76
D2  (via drill 0.51)
  Top 0.203: U3.41 44.45,40.43 44.45,40.39 v42.42,40.39 | v41.15,39.12 41.15,37.85 41.66,37.34 42.16,37.34 44.45,35.05 44.45,30.48 43.94,29.97 43.94,28.96 v44.7,28.19 | v47.24,25.65 47.75,25.65 52.07,21.34 53.59,21.34 65.02,9.91 v65.02,9.4 | v68.33,12.45 68.58,12.7 70.36,12.7 72.39,10.67 73.91,10.67 74.42,10.16 75.44,10.16 76.71,8.89 JP2.10 JP9.10
  Bottom 0.203: v41.15,39.12 v42.42,40.39 | v47.24,25.65 v44.7,28.19 | v65.02,9.4 68.07,12.45 v68.33,12.45
D3  (via drill 0.51)
  Top 0.203: JP9.9 JP2.9 90.93,13.21 90.93,14.99 90.42,15.49 90.42,17.27 89.92,17.78 89.92,19.56 89.41,20.07 89.41,21.08 76.2,34.29 v75.69,34.29 | v47.5,42.67 47.24,42.93 46.23,42.93 45.47,42.16 U3.40 | v55.37,51.05 57.15,51.05 63.75,57.66 63.75,59.44 | v63.75,60.71 63.75,59.44 | v63.75,62.23 64.01,61.98 66.29,61.98 72.39,68.07 JP7.3 | v74.17,38.86 71.88,41.15 69.85,41.15 66.04,44.96 v66.04,57.4 | 63.75,59.44 v64.01,59.44
  Bottom 0.203: v47.5,42.67 47.5,43.18 v55.37,51.05 | v63.75,62.23 v63.75,60.71 | v75.69,34.29 76.45,35.05 76.45,36.58 v74.17,38.86 | v64.01,59.44 v66.04,57.4
D4  (via drill 0.51)
  Top 0.203: U3.39 44.26,41.66 44.2,41.66 v44.2,41.4 | 83.82,68.33 74.17,68.33 64.26,58.42 64.26,57.4 57.66,50.8 v57.66,49.78 58.93,48.51 58.93,48.26 59.94,47.24 v61.72,47.24 | 83.82,68.33 85.09,67.06 R18.1 | JP9.8 JP2.8 90.93,15.75 90.93,17.53 90.42,18.03 90.42,19.81 89.92,20.32 89.92,21.34 75.69,35.56 v75.18,35.56 | v72.9,38.86 72.14,39.62 71.63,39.62 71.12,40.13 70.61,40.13 70.1,40.64 69.6,40.64 64.26,45.97 v64.26,46.48 | JP7.13 85.09,69.6 83.82,68.33
  Bottom 0.203: v44.2,41.4 49.28,41.4 50.8,42.93 50.8,43.94 52.07,45.21 52.32,44.96 52.83,44.96 v57.66,49.78 | v75.18,35.56 75.18,36.58 v72.9,38.86 | v64.26,46.48 63.5,47.24 v61.72,47.24
D5  (via drill 0.51)
  Top 0.203: U3.38 44.06,42.16 43.43,42.16 v42.93,41.66 | v58.67,50.55 58.67,51.05 60.96,53.34 | 60.96,53.34 64.77,57.15 64.77,58.17 74.17,67.56 v74.68,67.56 | v73.15,69.34 73.66,69.34 75.18,70.87 75.18,72.14 JP7.5 | JP9.7 JP2.7 90.93,18.29 90.93,20.07 90.42,20.57 90.42,21.59 75.44,36.58 74.42,36.58 v74.17,36.32 | v71.63,38.86 70.87,39.62 70.36,39.62 69.85,40.13 69.34,40.13 63.5,45.97 63.5,50.29 v63.75,50.55 | 60.96,53.34 v61.72,52.58
  Bottom 0.203: v42.93,41.66 43.94,42.67 46.23,42.67 46.74,43.18 46.74,43.69 47.24,44.2 47.75,44.2 54.61,51.05 54.61,51.56 54.86,51.82 57.4,51.82 v58.67,50.55 | v74.68,67.56 73.15,69.09 v73.15,69.34 | v71.63,38.86 v74.17,36.32 | v61.72,52.58 v63.75,50.55
D6  (via drill 0.51)
  Top 0.203: U3.37 43.86,42.67 41.4,42.67 v39.37,44.7 | v37.08,51.56 39.12,53.59 v42.42,53.59 | v44.45,55.63 47.75,55.63 51.82,59.69 v51.82,60.2 | v60.96,57.15 v54.86,57.15 | v75.95,67.56 75.18,66.8 74.17,66.8 65.28,57.91 65.28,56.9 63.5,55.12 v63.5,54.61 63.5,53.34 62.99,52.83 62.99,45.72 69.09,39.62 69.6,39.62 v70.36,38.86 | v77.47,69.09 80.01,71.63 JP7.9 | JP9.6 JP2.6 90.93,20.83 90.93,21.84 75.69,37.08 72.64,37.08 v72.39,36.83
  Bottom 0.203: v39.37,44.7 39.37,45.72 37.08,48.01 v37.08,51.56 | v44.45,55.63 v42.42,53.59 | v54.86,57.15 v51.82,60.2 | v63.5,54.61 v60.96,57.15 | v77.47,69.09 v75.95,67.56 | v70.36,38.86 v72.39,36.83
D7  (via drill 0.51)
  Top 0.203: U3.34 43.24,48.26 41.66,48.26 41.66,48.01 41.4,48.01 40.39,46.99 v40.39,46.48 | v38.35,51.56 38.61,51.31 44.2,51.31 54.36,61.47 59.69,61.47 | 59.69,61.47 66.55,61.47 JP7.7 | JP9.5 JP2.5 91.95,21.59 75.95,37.59 70.87,37.59 v70.61,37.34 | v69.09,38.86 62.48,45.47 v62.48,53.59 | 59.69,61.47 v59.69,57.91
  Bottom 0.203: v40.39,46.48 38.35,48.51 v38.35,51.56 | v69.09,38.86 v70.61,37.34 | v62.48,53.59 59.69,56.39 v59.69,57.91
GND  (via drill 0.3, 0.51)
  Top 0.203: v49.53,35.81 C10.2 48.09,37.25 47.5,37.85 47.5,39.24 U3.47 | v40.64,44.45 C11.2 42.33,45.38 43.43,46.48 44.32,46.48 U3.35 | v56.9,35.05 56.77,35.18 C13.2 | C8.2 58.42,25.44 v58.42,24.13 | v51.05,28.96 51.18,28.83 C9.2 | U3.23 50.16,48.26 49.78,48.26 49.53,48.51 49.53,49.53 48.68,50.38 C7.2 48.77,50.76 v48.77,52.07 | U3.8 54.61,40.43 v54.61,39.88 | v14.73,32.26 14.48,32.26 14.48,32 13.46,32 13.46,32.26 | 13.46,32.26 R2.1 | v25.15,53.34 23.37,53.34 23.11,53.59 22.86,53.34 | v25.15,45.72 23.37,45.72 23.11,45.97 22.86,45.72 C2.C | 11.68,61.72 9.65,61.72 8.38,60.45 5.59,60.45 4.32,61.72 BTN.P$1 | C5.1 11.94,63.25 11.94,61.98 RESET.P$1 11.68,61.72 | 11.68,61.72 v11.68,59.94 | v5.33,69.34 5.33,71.12 LED3.C 5.59,71.12 5.59,72.39 | 5.59,72.39 5.59,73.66 LED1.C | 5.59,72.39 LED2.C | v36.07,65.28 C6.2 | v28.7,58.67 28.96,58.93 28.96,59.69 28.7,59.94 27.94,59.94 U4.4 | v90.17,62.99 R16.1 90.17,65.28 92.71,65.28 R17.1 | R15.1 v82.55,62.99 | v89.66,38.35 87.63,38.35 87.38,38.61 87.12,38.35 C12.C | v7.87,12.19 7.62,11.94 7.62,10.67 7.37,10.41 | 7.37,10.41 6.86,10.41 U2.GND@40 | U2.GND@41 6.86,13.97 v8.64,13.97 10.92,13.97 U2.GND@38 | U2.GND@42 6.6,17.53 v4.83,17.53 4.83,17.78 | v9.65,15.75 9.65,17.27 9.91,17.53 10.92,17.53 U2.GND@39 | 7.37,10.41 10.92,10.41 U2.GND@37 | 7.37,10.41 U2.GND@40 | v11.18,8.13 10.92,8.38 10.67,8.13 10.67,6.86 U2.GND@34 10.57,6.71 9.55,6.71 U2.GND@33 9.4,6.86 9.4,7.87 8.38,7.87 8.38,6.86 U2.GND@32 8.13,6.86 7.11,6.86 U2.GND@31 | U2.GND@40 6.6,10.41 4.83,10.41 4.57,10.67 4.57,11.94 4.32,12.19 3.05,12.19 U2.GND@25 | 1.27,17.02 1.02,16.76 1.02,16 1.27,15.75 2.79,15.75 U2.GND@22
  Top 0.203: 1.27,17.02 2.79,17.02 U2.EXT_32K | 1.27,17.02 1.02,17.27 1.02,17.78 1.27,18.03 2.79,18.03 U2.GND@20 3.05,18.03 4.57,18.03 4.83,17.78 | 4.57,21.08 3.05,21.08 U2.GND@45 | 4.57,21.08 4.57,18.29 4.83,18.03 4.83,17.78 | 4.57,21.08 U2.GND@18 | 22.86,53.34 22.1,53.34 21.59,52.83 U1.2 | 22.86,53.34 C1.C | v3.56,44.96 3.3,44.7 1.27,44.7 X1.MT1 | v5.08,38.1 4.57,38.1 3.56,39.12 3.56,39.37 3.81,39.37 X1.GND | v3.05,36.32 2.79,36.58 1.27,36.58 X1.MT2 | v1.52,7.11 1.52,6.86 1.78,6.6 2.79,6.6 U2.GND@46 | 13.21,7.87 13.21,6.86 U2.GND@36 13.21,6.6 14.73,6.6 U2.GND@43 | v13.46,8.13 13.21,7.87 | 13.21,7.87 13.21,8.64 14.73,8.64 U2.GND@1 | U2.GND@11 13.21,21.13 14.63,21.13 U2.GND@44 14.83,21.34 14.83,22.15 15.24,22.55 v15.24,22.61 | U2.GND@10 14.83,19.3 14.83,18.29 U2.GND@9 14.83,18.09 v16.05,18.09 | C3.2 5.69,23.16 5.69,24.59 v5.59,24.64 | v7.32,22.35 7.11,22.15 7.11,21.34 U2.GND@16 | 13.46,32.26 13.37,32.35 Q1.1
  Top 0.254: U2.GND@36 13.09,5.54 L1.2 | U2.GND@31 7.09,5.73 R10.1
  Bottom 0.203: v36.07,65.28 29.46,58.67 v28.7,58.67 | v3.56,44.96 3.56,44.45 4.57,43.43 4.57,38.61 v5.08,38.1
  other vias: 7.62,8.13 2.29,22.61 16.26,6.86 5.33,39.12 4.06,64.01
  pour Bottom: 0,80.01 0,0 100.33,0 100.33,80.01
LED1  (via drill 0.51)
  Top 0.203: U3.29 44.7,50.34 44.7,50.29 44.2,50.8 35.81,50.8 29.46,57.15 29.46,59.94 28.96,60.45 26.16,60.45 19.81,66.8 19.05,66.8 13.72,72.14 v13.72,72.64 | v12.45,71.37 11.43,72.39 R12.2
  Bottom 0.203: v13.72,72.64 v12.45,71.37
LED2  (via drill 0.51)
  Top 0.203: U3.30 43.94,50.39 43.94,50.29 35.56,50.29 19.56,66.29 17.27,66.29 v16,67.56 | v14.48,69.09 11.18,69.09 10.92,69.34 11.01,69.43 R13.2
  Bottom 0.203: v16,67.56 v14.48,69.09
MEM_CS  (via drill 0.51)
  Top 0.203: U3.46 45.97,38.42 45.97,33.53 | 45.97,33.53 45.97,7.11 43.18,4.32 TP7.TP | R14.1 29.72,65.28 29.72,63.75 27.94,63.75 U4.1 27.69,63.75 v26.42,63.75 | v27.94,53.59 29.97,53.59 34.04,49.53 v34.04,46.23 | v37.08,41.15 41.4,36.83 41.91,36.83 43.69,35.05 v43.69,34.54 | 45.97,33.53 v46.23,33.53
  Bottom 0.203: v26.42,63.75 26.92,63.25 26.92,54.61 v27.94,53.59 | v34.04,46.23 34.29,45.97 34.29,44.45 36.32,42.42 36.32,41.91 v37.08,41.15 | v43.69,34.54 45.21,34.54 v46.23,33.53
N$1
  Top 0.203: R3.1 7.37,38.35 7.37,39.88 R5.2 7.37,40.13 6.1,40.13 5.59,40.64 X1.D+
N$2
  Top 0.203: R12.1 LED2.A
N$3
  Top 0.203: D1.2 16.89,47.88 F1.2
N$4
  Top 0.254: 11.85,6.65 U2.RF_ANT | 11.94,4.99 L1.1
  Top 0.406: L1.1 11.85,6.65 | C4.2 11.94,4.99
N$5
  Top 0.254: 9.69,2.07 9.65,2.03 A1.FEED
  Top 0.406: C4.1 9.69,2.07
N$6
  Top 0.203: R6.2 6.35,41.66 5.98,41.29 X1.D-
N$7
  Top 0.203: U2.SCL_CC3000 5.84,6.86 5.84,7.87 4.57,7.87 4.57,6.86 U2.SCL_EEPROM
N$8
  Top 0.203: R4.2 16.51,34.54 15.49,34.54 15.11,34.92 Q1.2
N$9  (via drill 0.3)
  Top 0.203: v19.1,15.44 17.48,15.44 16.66,16.26 15.85,16.26 15.44,15.85 14.83,15.85 U2.WL_EN1 | v16.46,13.21 16.33,13.34 U2.WL_EN2
  Bottom 0.203: v16.46,13.21 18.69,15.44 v19.1,15.44
N$10
  Top 0.203: R13.1 9.06,71.12 LED3.A
N$11
  Top 0.203: JP7.19 R17.2
N$12
  Top 0.203: JP7.11 83.72,73.56 85.55,73.56 86.16,72.95 86.16,66.45 85.75,66.04 84.33,66.04 83.52,66.85 82.7,66.85 R15.2
N$13  (via drill 0.51)
  Top 0.203: R2.2 11.94,32.26 11.94,34.29 Q1.6 Q1.5 9.53,34.92 8.64,35.81 8.64,36.58 v8.38,36.83 | R1.1 8.89,43.18 9.14,42.93 9.4,43.18 9.91,43.18 10.92,42.16 v10.92,41.4
  Bottom 0.203: v10.92,41.4 10.92,39.37 v8.38,36.83
N$14
  Top 0.203: JP7.17 R16.2
N$15
  Top 0.203: U2.SDA_CC3000 2.79,8.64 0.76,8.64 0.51,8.89 0.51,9.4 0.76,9.65 2.79,9.65 U2.SDA_EEPROM
N$16
  Top 0.203: R3.2 9.14,38.35 9.14,36.07 9.65,35.56 11.68,35.56 Q1.4
N$38
  Top 0.203: R8.1 9.06,73.66 LED1.A
OSC1  (via drill 0.51)
  Top 0.203: Y1.3 56.89,27.27 C8.1 58.42,27.43 58.42,28.96 58.17,29.21 v57.4,29.21 | U3.6 53.34,40.29 53.34,33.27 v56.13,30.48
  Bottom 0.203: v57.4,29.21 v56.13,30.48
OSC2
  Top 0.203: C9.1 51.48,25.27 Y1.1 52.83,25.15 50.55,25.15 49.78,25.91 49.78,28.7 52.83,31.75 52.83,40.09 U3.5
RAW  (via drill 0.3, 0.51)
  Top 0.203: 20.32,52.07 17.78,52.07 D1.1 | 20.32,52.07 20.57,51.82 20.57,51.05 U1.3 | 20.07,53.34 C1.A 20.19,53.31 | JP1.1 JP8.1 v66.04,31.75 | v52.07,35.81 50.55,35.81 49.53,34.8 v46.74,34.8 | v38.1,43.43 v44.7,36.83 | v36.07,45.47 27.94,45.47 22.86,50.55 22.61,50.55 22.54,50.61 U1.1 22.55,50.8 v23.57,51.82 | v21.54,53.85 21.13,53.44 20.32,53.44 20.19,53.31 | 20.32,52.07 20.19,52.2 20.19,53.31
  Bottom 0.203: v66.04,31.75 61.98,35.81 v52.07,35.81 | v44.7,36.83 v46.74,34.8 | v36.07,45.47 v38.1,43.43 | v23.57,51.82 v21.54,53.85
RX  (via drill 0.3, 0.51)
  Top 0.203: U3.13 55.2,46.23 56.39,46.23 56.49,46.13 | v60.45,32.77 69.09,24.13 JP8.4 JP1.4 | v58.93,34.29 59.18,34.54 59.18,43.43 56.49,46.13 | 56.49,46.13 v56.49,45.92
  Bottom 0.203: v58.93,34.29 v60.45,32.77 | JP3.2 55.88,55.07 59.94,51 59.94,49.38 v56.49,45.92
SPI_MISO  (via drill 0.51)
  Top 0.203: U3.27 46.23,50.23 46.23,51.82 46.74,52.32 v46.74,52.58 | v45.47,53.85 44.2,53.85 37.59,60.45 32,60.45 29.97,62.48 29.84,62.36 U4.2 27.71,62.48 v26.16,62.48 | TP2.TP 24.13,6.86 v22.86,8.13 | v20.83,10.16 20.83,10.92 v16.26,15.49 | U2.SPI_DOUT 10.67,21.34 10.67,21.84 10.41,22.1 9.4,22.1 8.89,22.61 v8.64,22.61 8.38,22.86 8.38,33.53 2.79,39.12 2.79,42.16 5.33,44.7 6.35,44.7 21.34,59.69 v23.37,59.69
  Bottom 0.203: v45.47,53.85 v46.74,52.58 | v20.83,10.16 v22.86,8.13 | v16.26,15.49 9.14,22.61 v8.64,22.61 | v23.37,59.69 v26.16,62.48
SPI_MOSI  (via drill 0.51)
  Top 0.203: U3.28 45.47,50.28 v45.47,51.31 | v44.2,52.58 44.2,53.09 42.42,54.86 | 42.42,54.86 37.34,59.94 35.31,59.94 U4.5 | TP1.TP 20.32,7.62 v19.81,8.13 | v13.21,14.73 13.21,18.03 12.19,19.05 9.4,19.05 8.89,19.56 8.64,19.56 8.38,19.81 8.38,21.08 U2.SPI_DIN | v20.32,22.1 20.07,22.35 20.07,31.24 20.32,31.5 20.32,33.27 26.16,39.12 33.27,39.12 36.58,42.42 v37.08,42.42 | v35.81,52.07 36.32,52.07 36.58,52.32 37.08,52.32 38.86,54.1 41.66,54.1 42.42,54.86
  Bottom 0.203: v44.2,52.58 v45.47,51.31 | v19.81,8.13 v13.21,14.73 15.24,14.73 15.75,14.22 16.76,14.22 20.07,17.53 20.07,21.84 v20.32,22.1 | v37.08,42.42 34.8,44.7 34.8,51.05 v35.81,52.07
SPI_SCK  (via drill 0.51)
  Top 0.203: U3.26 46.99,50.17 46.99,51.82 47.24,51.82 47.75,52.32 v47.75,53.59 | v46.48,54.86 43.94,54.86 37.85,60.96 37.34,60.96 37.08,61.21 35.31,61.21 U4.6 35.05,61.21 33.02,61.21 32,62.23 v32,63.5 | TP3.TP 27.94,4.32 23.37,8.89 18.29,8.89 v18.03,8.64 | v8.89,17.78 8.89,18.03 7.62,19.3 6.1,19.3 5.84,19.56 5.84,21.08 U2.SPI_CLK 5.84,21.34 5.84,21.84 6.86,22.86 6.86,24.38 v6.6,24.64 | v6.6,26.16 7.87,27.43 7.87,33.27 3.56,37.59 v3.05,37.59 | v3.05,43.69 3.56,43.69 5.08,45.21 6.1,45.21 21.08,60.2 21.59,60.2 v22.1,60.71
  Bottom 0.203: v46.48,54.86 v47.75,53.59 | v8.89,17.78 v18.03,8.64 | v6.6,26.16 v6.6,24.64 | v3.05,43.69 v3.05,37.59 | v22.1,60.71 25.91,64.52 30.99,64.52 v32,63.5
TX  (via drill 0.51)
  Top 0.203: U3.12 55.7,42.16 57.91,42.16 v58.42,42.67 | v61.72,45.97 61.72,45.47 65.28,41.91 65.28,30.48 69.09,26.67 JP8.3 JP1.3
  Bottom 0.203: v61.72,45.97 60.4,44.65 | 60.4,44.65 v58.42,42.67 | JP3.4 60.96,60.96 58.52,58.52 58.52,53.03 60.35,51.21 60.35,44.7 60.4,44.65
USB_DISC  (via drill 0.51)
  Top 0.203: U3.21 53.34,50.03 53.34,51.31 v49.53,55.12 | TP6.TP 39.37,4.32 36.32,7.37 33.02,7.37 31.75,8.64 v31.24,8.64 | v30.48,10.16 30.48,10.67 22.86,18.29 21.34,18.29 19.56,20.07 v19.56,32 | v18.29,33.27 18.29,34.54 R4.1 18.29,34.8 18.38,34.89 R7.2 | 18.29,35.81 R7.2 | v21.08,39.37 20.83,39.62 19.81,39.62 18.29,38.1 18.29,36.28 R7.2 | v26.92,45.21 v23.11,41.4 | v32,50.29 v28.19,46.48 | v34.8,53.09 37.08,53.09 38.61,54.61 40.89,54.61 v41.15,54.86 | v47.75,56.9 v43.18,56.9 | 18.29,36.07 R7.2
  Bottom 0.203: v31.24,8.64 31.24,9.4 v30.48,10.16 | v18.29,33.27 v19.56,32 | v23.11,41.4 v21.08,39.37 | v28.19,46.48 v26.92,45.21 | v34.8,53.09 v32,50.29 | v43.18,56.9 v41.15,54.86 | v49.53,55.12 v47.75,56.9
USBM
  Top 0.203: U3.32 43.64,49.28 41.15,49.28 32.51,40.64 10.41,40.64 9.14,41.91 8.89,41.66 R6.1
USBP
  Top 0.203: U3.33 43.44,48.77 41.4,48.77 32.77,40.13 9.14,40.13 R5.1
UVCC
  Top 0.203: X1.VBUS 4.06,41.91 5.84,41.91 6.1,42.16 6.35,42.16 7.37,43.18 R1.2 7.37,43.43 7.37,44.96 11.94,49.53 17.53,49.53 18.41,50.42 F1.1
VDDA  (via drill 0.51)
  Top 0.203: U3.9 55.11,40.64 56.13,40.64 56.39,40.39 56.64,40.39 56.9,40.13 v56.9,39.62 56.9,38.35 C13.1 56.64,38.1 55.37,36.83 55.37,35.31 55.63,35.05 v55.63,32.26 | JP2.3 JP9.3 98.55,26.67 99.57,27.69 99.57,33.27 97.03,35.81 84.58,35.81 84.33,36.07 84.33,38.35 | TP11.TP 58.42,15.75 53.34,20.83 51.82,20.83 48.26,24.38 v47.75,24.38 | 80.77,38.35 84.33,38.35 | 84.33,38.35 C12.A | 80.77,38.35 80.77,37.85 79.76,37.85 79.76,38.86 v78.74,39.88 | 80.77,38.35 L2.2 | v76.96,41.66 70.1,41.66 66.8,44.96 v66.8,45.47
  Bottom 0.203: v55.63,32.26 v47.75,24.38 | v76.96,41.66 v78.74,39.88 | v66.8,45.47 60.96,39.62 v56.9,39.62
WIFI_CS  (via drill 0.51)
  Top 0.203: v42.16,46.48 41.66,46.48 40.64,45.47 38.86,45.47 33.02,39.62 25.91,39.62 11.68,25.4 11.68,23.11 R9.1 11.79,22.96 12.42,22.33 | v47.24,44.96 47.24,46.48 48.51,47.75 48.51,48.01 49.02,48.51 49.02,48.85 U3.25 | TP4.TP 31.75,5.59 v28.7,8.64 | v27.94,10.16 27.94,11.68 22.35,17.27 20.83,17.27 18.8,19.3 v18.29,19.3 | v18.29,20.83 15.75,23.37 13.46,23.37 12.42,22.33 | 12.42,22.33 11.94,21.84 11.94,21.34 U2.SPI_CS
  Bottom 0.203: v42.16,46.48 44.96,43.69 45.97,43.69 v47.24,44.96 | v28.7,8.64 28.7,9.4 v27.94,10.16 | v18.29,20.83 v18.29,19.3
WIFI_EN  (via drill 0.51)
  Top 0.203: U3.45 45.47,38.62 45.47,7.37 44.7,6.6 v44.2,6.6 42.93,7.87 33.27,7.87 31.75,9.4 v16,9.4 | v13.21,9.4 12.7,9.4 12.19,8.89 10.67,8.89 10.16,8.38 8.38,8.38 7.87,8.89 7.11,8.89 6.6,8.38 3.99,8.38
  Top 0.254: R10.2 4.74,5.14 3.99,5.89 3.99,8.38 3.99,10.62 3.68,10.92 3.06,10.92 U2.VBAT_SW_EN
  Bottom 0.203: TP8.TP v44.2,6.6 | v13.21,9.4 v16,9.4
WIFI_INT  (via drill 0.51)
  Top 0.203: v52.07,38.86 51.82,38.86 51.82,38.61 51.05,37.85 v51.05,36.58 | v52.07,43.69 52.07,44.7 49.78,46.99 49.78,47.18 U3.22 | v50.8,34.8 46.48,30.48 46.48,6.86 45.47,5.84 45.47,4.57 44.96,4.06 44.96,3.3 42.16,0.51 38.35,0.51 35.56,3.3 TP5.TP 35.56,4.32 33.02,6.86 32.77,6.86 31.75,7.87 30.73,7.87 v29.97,8.64 | v29.21,10.16 29.21,11.18 22.61,17.78 21.08,17.78 18.8,20.07 13.97,20.07 13.46,19.56 9.65,19.56 9.4,19.81 9.4,21.08 U2.SPI_IRQ
  Bottom 0.203: v52.07,43.69 v52.07,38.86 | v51.05,36.58 50.8,36.32 v50.8,34.8 | v29.97,8.64 29.97,9.4 v29.21,10.16
WIFI_RX  (via drill 0.51)
  Top 0.203: v21.34,16.51 21.08,16.76 20.57,16.76 20.32,17.02 15.49,17.02 15.42,16.94 U2.WL_RS232_RX
  Bottom 0.203: v21.34,16.51 24.13,19.3 JP4.2
WIFI_TX  (via drill 0.51)
  Top 0.203: JP4.4 29.21,19.56 v26.42,16.76 | v18.8,14.22 v23.88,14.22 | v17.53,12.95 17.53,13.46 16.51,14.48 14.99,14.48 U2.WL_RS232_TX
  Bottom 0.203: v23.88,14.22 v26.42,16.76 | v17.53,12.95 v18.8,14.22

### Text on the board
tPlace: BOOT0 | PWR | 1 | 2 | BOOT1 | RST | STM32 UART | BTN | VCC | RAW | RST | GND | VDDA | TX | GND | RX | CC3000 UART | D7 | A7 | D6 | A6 | D5 | A5 | D4 | A4 | D3 | A3 | D2 | A2 | D1 | SPI MOSI | SPI MISO | SPI SCK | WIFI CS | WIFI INT | USB DISC | MEM CS | WIFI EN | +3V3 | GND | VDDA | A1 | D0 | A0